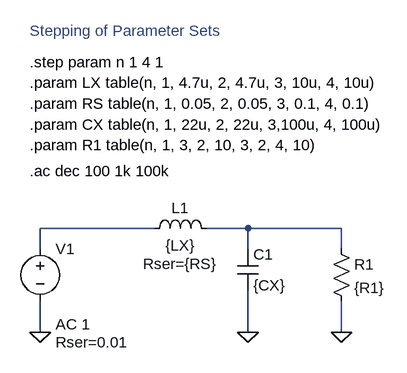
[diagram p0: schematic step_parameter_sets.asc]
step_parameter_sets.asc, the LTspice schematic file:
Version 4
SHEET 1 880 680
WIRE 32 128 -144 128
WIRE 176 128 112 128
WIRE 320 128 176 128
WIRE -144 160 -144 128
WIRE 176 160 176 128
WIRE 320 160 320 128
WIRE -144 288 -144 240
WIRE 176 288 176 224
WIRE 320 288 320 240
FLAG -144 288 0
FLAG 176 288 0
FLAG 320 288 0
SYMBOL res 304 144 R0
SYMATTR InstName R1
SYMATTR Value {R1}
SYMBOL cap 160 160 R0
SYMATTR InstName C1
SYMATTR Value {CX}
SYMBOL ind 16 144 R270
WINDOW 0 32 56 VTop 0
WINDOW 3 5 56 VBottom 0
WINDOW 39 -23 56 VBottom 0
SYMATTR InstName L1
SYMATTR Value {LX}
SYMATTR SpiceLine Rser={RS}
SYMBOL voltage -144 144 R0
WINDOW 123 24 132 Left 0
WINDOW 39 24 160 Left 0
SYMATTR InstName V1
SYMATTR Value ""
SYMATTR Value2 AC 1
SYMATTR SpiceLine Rser=0.01
TEXT -160 40 Left 0 !.ac dec 100 1k 100k
TEXT -160 -128 Left 0 !.step param n 1 4 1
TEXT -160 -96 Left 0 !.param LX table(n, 1, 4.7u, 2, 4.7u, 3, 10u, 4, 10u)
TEXT -160 -32 Left 0 !.param CX table(n, 1, 22u, 2, 22u, 3,100u, 4, 100u)
TEXT -160 0 Left 0 !.param R1 table(n, 1, 3, 2, 10, 3, 2, 4, 10)
TEXT -160 -64 Left 0 !.param RS table(n, 1, 0.05, 2, 0.05, 3, 0.1, 4, 0.1)
TEXT -160 -176 Left 0 ;Stepping of Parameter Sets

The netlist it stands for:
* step_parameter_sets.asc
R1 N002 0 {R1}
C1 N002 0 {CX}
L1 N001 N002 {LX} Rser={RS}
V1 N001 0 AC 1 Rser=0.01
.ac dec 100 1k 100k
.step param n 1 4 1
.param LX table(n, 1, 4.7u, 2, 4.7u, 3, 10u, 4, 10u)
.param CX table(n, 1, 22u, 2, 22u, 3,100u, 4, 100u)
.param R1 table(n, 1, 3, 2, 10, 3, 2, 4, 10)
.param RS table(n, 1, 0.05, 2, 0.05, 3, 0.1, 4, 0.1)
* Stepping of Parameter Sets
.backanno
.end